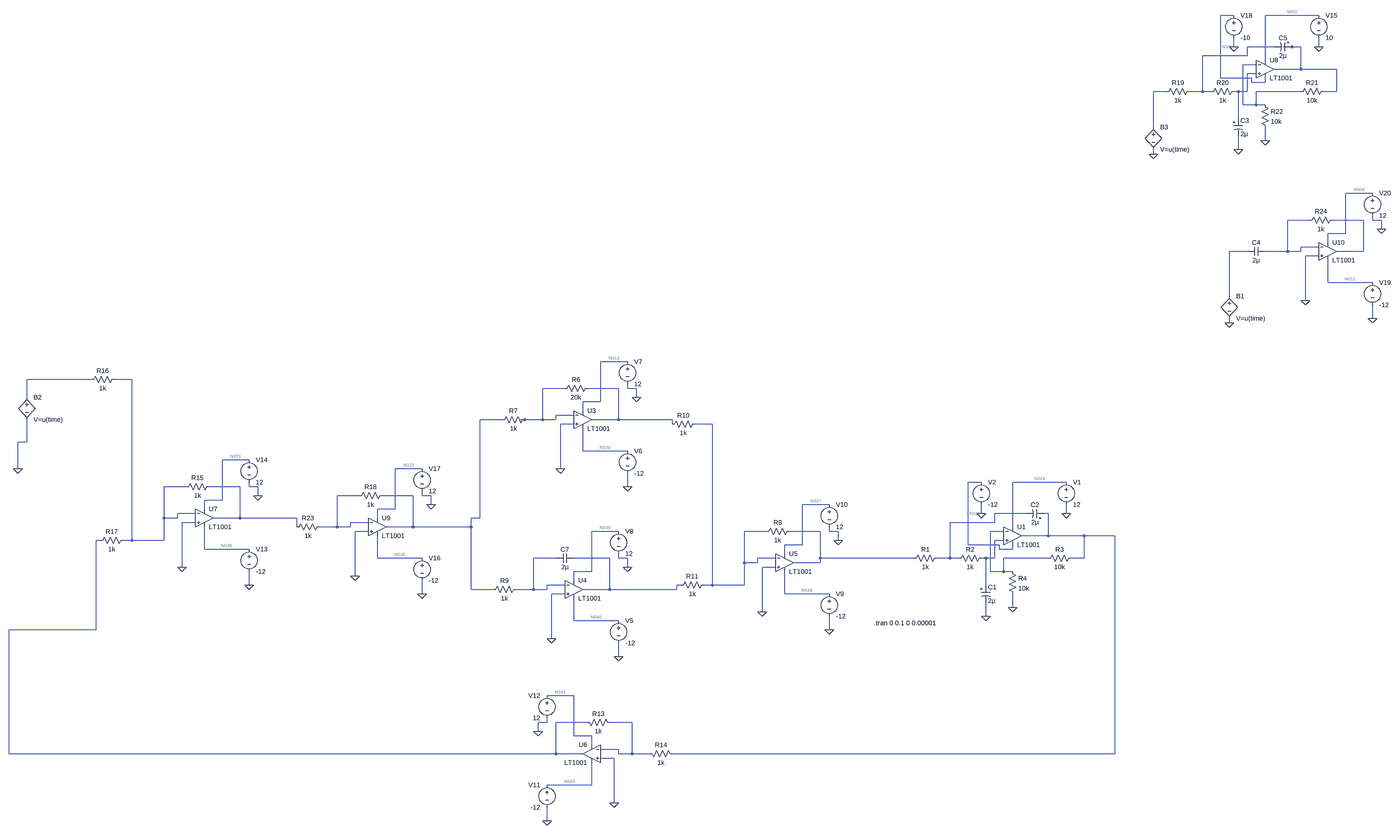
[diagram p0: schematic PI_Controller.asc, whole sheet]
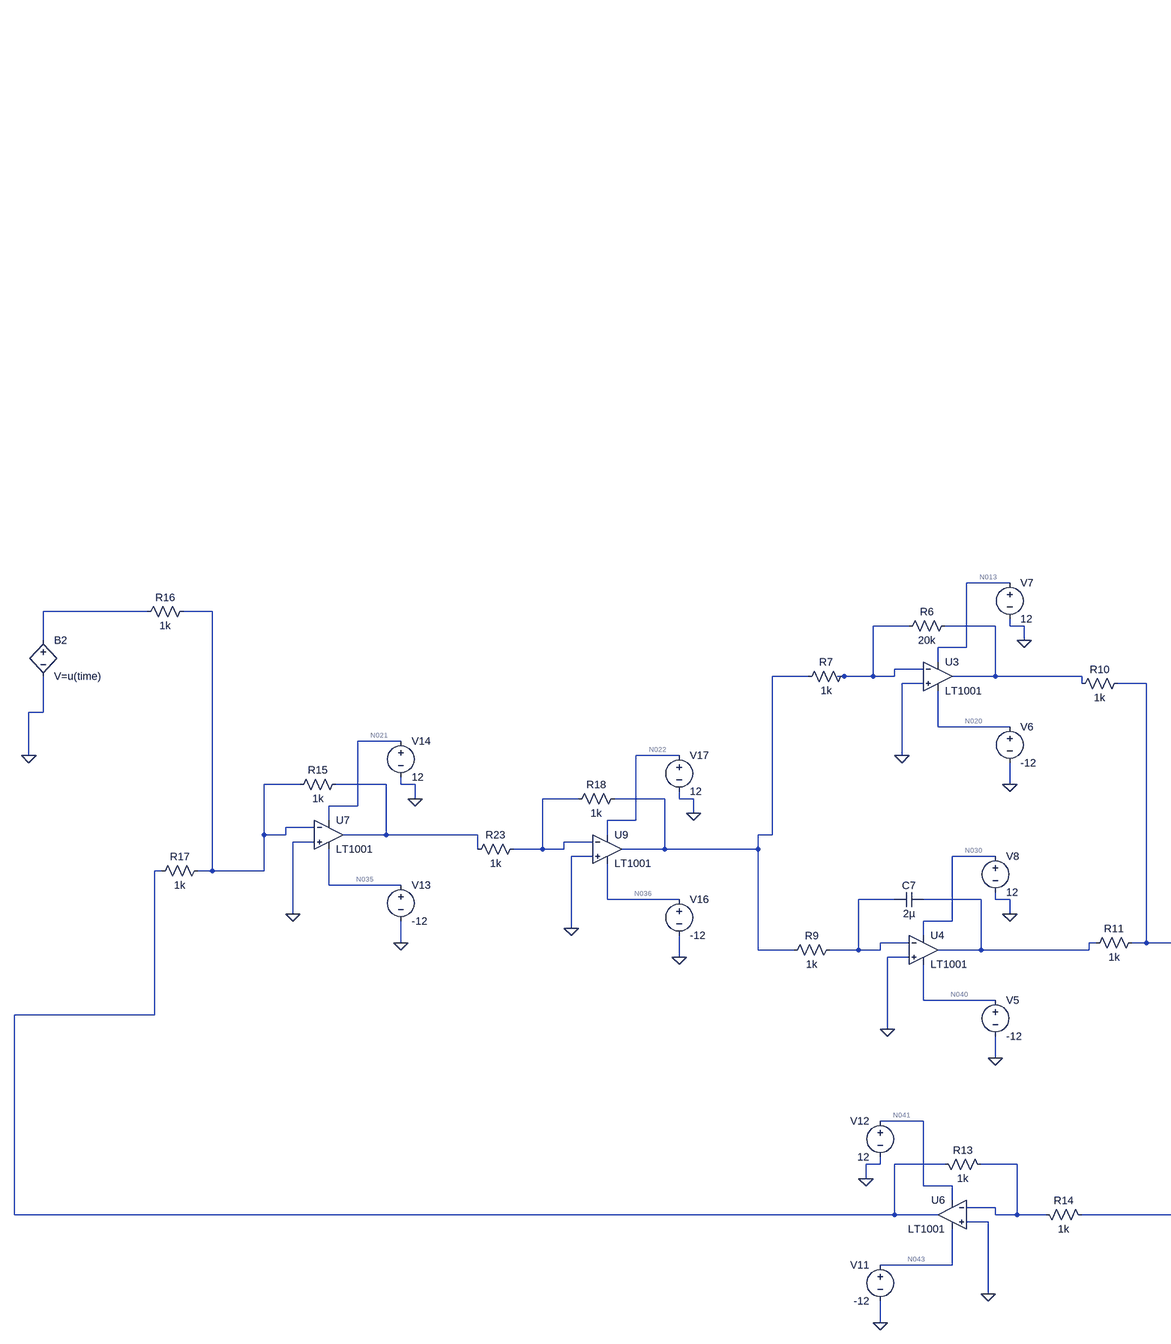
[diagram p1: schematic PI_Controller.asc, part, row 1 of 1, column 1 of 2]
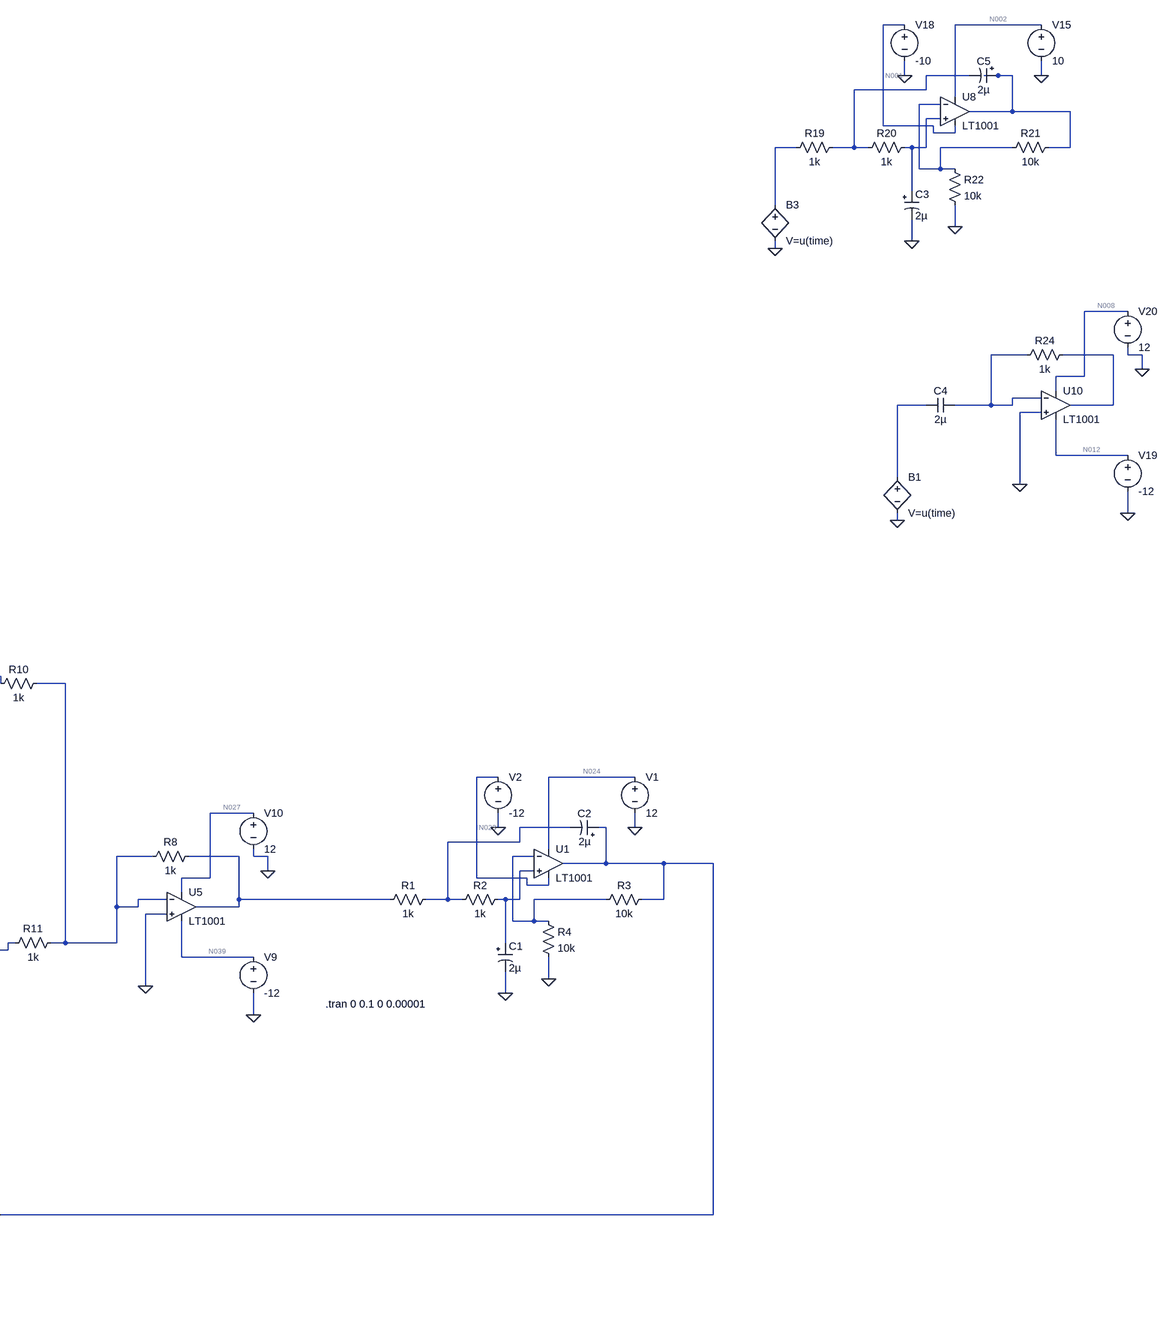
[diagram p2: schematic PI_Controller.asc, part, row 1 of 1, column 2 of 2]
PI_Controller.asc, the LTspice schematic file:
Version 4
SHEET 1 4088 1172
WIRE 3520 -2896 3472 -2896
WIRE 3824 -2896 3632 -2896
WIRE 3520 -2784 3520 -2816
WIRE 3664 -2784 3568 -2784
WIRE 3728 -2784 3696 -2784
WIRE 3760 -2784 3728 -2784
WIRE 3824 -2784 3824 -2816
WIRE 3568 -2752 3568 -2784
WIRE 3568 -2752 3408 -2752
WIRE 3632 -2736 3632 -2896
WIRE 3600 -2720 3552 -2720
WIRE 3760 -2704 3760 -2784
WIRE 3760 -2704 3664 -2704
WIRE 3888 -2704 3760 -2704
WIRE 3600 -2688 3568 -2688
WIRE 3472 -2672 3472 -2896
WIRE 3584 -2672 3472 -2672
WIRE 3584 -2656 3584 -2672
WIRE 3632 -2656 3632 -2672
WIRE 3632 -2656 3584 -2656
WIRE 3280 -2624 3232 -2624
WIRE 3408 -2624 3408 -2752
WIRE 3408 -2624 3360 -2624
WIRE 3440 -2624 3408 -2624
WIRE 3536 -2624 3520 -2624
WIRE 3568 -2624 3568 -2688
WIRE 3568 -2624 3536 -2624
WIRE 3760 -2624 3600 -2624
WIRE 3888 -2624 3888 -2704
WIRE 3888 -2624 3840 -2624
WIRE 3552 -2576 3552 -2720
WIRE 3600 -2576 3600 -2624
WIRE 3600 -2576 3552 -2576
WIRE 3632 -2576 3600 -2576
WIRE 3536 -2528 3536 -2624
WIRE 3232 -2496 3232 -2624
WIRE 3632 -2448 3632 -2496
WIRE 3536 -2416 3536 -2464
WIRE 3232 -2400 3232 -2416
WIRE 4016 -2256 3920 -2256
WIRE 3792 -2160 3712 -2160
WIRE 3984 -2160 3872 -2160
WIRE 4016 -2160 4016 -2176
WIRE 4048 -2160 4016 -2160
WIRE 4048 -2128 4048 -2160
WIRE 3920 -2112 3920 -2256
WIRE 3920 -2112 3856 -2112
WIRE 3856 -2080 3856 -2112
WIRE 3824 -2064 3760 -2064
WIRE 3568 -2048 3504 -2048
WIRE 3712 -2048 3712 -2160
WIRE 3712 -2048 3632 -2048
WIRE 3760 -2048 3760 -2064
WIRE 3760 -2048 3712 -2048
WIRE 3984 -2048 3984 -2160
WIRE 3984 -2048 3888 -2048
WIRE 3824 -2032 3776 -2032
WIRE 3856 -1936 3856 -2016
WIRE 4016 -1936 3856 -1936
WIRE 3504 -1888 3504 -2048
WIRE 3776 -1872 3776 -2032
WIRE 4016 -1808 4016 -1856
WIRE 3504 -1792 3504 -1808
WIRE -544 -1360 -640 -1360
WIRE -3408 -1296 -3648 -1296
WIRE -3264 -1296 -3328 -1296
WIRE -768 -1264 -848 -1264
WIRE -576 -1264 -688 -1264
WIRE -544 -1264 -544 -1280
WIRE -512 -1264 -544 -1264
WIRE -3648 -1232 -3648 -1296
WIRE -512 -1232 -512 -1264
WIRE -640 -1216 -640 -1360
WIRE -640 -1216 -704 -1216
WIRE -704 -1184 -704 -1216
WIRE -736 -1168 -800 -1168
WIRE -992 -1152 -1072 -1152
WIRE -912 -1152 -928 -1152
WIRE -848 -1152 -848 -1264
WIRE -848 -1152 -912 -1152
WIRE -800 -1152 -800 -1168
WIRE -800 -1152 -848 -1152
WIRE -576 -1152 -576 -1264
WIRE -576 -1152 -672 -1152
WIRE -384 -1152 -576 -1152
WIRE -736 -1136 -784 -1136
WIRE -384 -1136 -384 -1152
WIRE -240 -1136 -304 -1136
WIRE -3648 -1072 -3648 -1152
WIRE -3648 -1072 -3680 -1072
WIRE -704 -1040 -704 -1120
WIRE -544 -1040 -704 -1040
WIRE -2768 -1008 -2864 -1008
WIRE -3680 -976 -3680 -1072
WIRE -1824 -976 -1920 -976
WIRE -784 -976 -784 -1136
WIRE 800 -928 752 -928
WIRE 1104 -928 912 -928
WIRE -2992 -912 -3072 -912
WIRE -2800 -912 -2912 -912
WIRE -2768 -912 -2768 -928
WIRE -2736 -912 -2768 -912
WIRE -544 -912 -544 -960
WIRE -2736 -880 -2736 -912
WIRE -2048 -880 -2128 -880
WIRE -1856 -880 -1968 -880
WIRE -1824 -880 -1824 -896
WIRE -1792 -880 -1824 -880
WIRE -2864 -864 -2864 -1008
WIRE -2864 -864 -2928 -864
WIRE -1792 -848 -1792 -880
WIRE 256 -848 160 -848
WIRE -2928 -832 -2928 -864
WIRE -1920 -832 -1920 -976
WIRE -1920 -832 -1984 -832
WIRE -2960 -816 -3024 -816
WIRE 800 -816 800 -848
WIRE 960 -816 848 -816
WIRE 1040 -816 1024 -816
WIRE 1104 -816 1104 -848
WIRE -3072 -800 -3072 -912
WIRE -3024 -800 -3024 -816
WIRE -3024 -800 -3072 -800
WIRE -2800 -800 -2800 -912
WIRE -2800 -800 -2896 -800
WIRE -2272 -800 -2800 -800
WIRE -1984 -800 -1984 -832
WIRE -1072 -800 -1072 -1152
WIRE -1072 -800 -1104 -800
WIRE -2960 -784 -3008 -784
WIRE -2016 -784 -2080 -784
WIRE 848 -784 848 -816
WIRE 848 -784 688 -784
WIRE -2272 -768 -2272 -800
WIRE -2128 -768 -2128 -880
WIRE -2128 -768 -2192 -768
WIRE -2080 -768 -2080 -784
WIRE -2080 -768 -2128 -768
WIRE -1856 -768 -1856 -880
WIRE -1856 -768 -1952 -768
WIRE -1104 -768 -1104 -800
WIRE -1104 -768 -1856 -768
WIRE 912 -768 912 -928
WIRE -2016 -752 -2064 -752
WIRE -576 -752 -672 -752
WIRE 32 -752 -48 -752
WIRE 224 -752 112 -752
WIRE 256 -752 256 -768
WIRE 288 -752 256 -752
WIRE 880 -752 832 -752
WIRE 1040 -736 1040 -816
WIRE 1040 -736 944 -736
WIRE 1168 -736 1040 -736
WIRE 1408 -736 1168 -736
WIRE -3376 -720 -3392 -720
WIRE -3264 -720 -3264 -1296
WIRE -3264 -720 -3296 -720
WIRE -3072 -720 -3072 -800
WIRE -3072 -720 -3264 -720
WIRE 288 -720 288 -752
WIRE 880 -720 848 -720
WIRE 160 -704 160 -848
WIRE 160 -704 96 -704
WIRE 752 -704 752 -928
WIRE 864 -704 752 -704
WIRE -2928 -688 -2928 -768
WIRE -2768 -688 -2928 -688
WIRE 864 -688 864 -704
WIRE 912 -688 912 -704
WIRE 912 -688 864 -688
WIRE 96 -672 96 -704
WIRE -1984 -656 -1984 -736
WIRE -1824 -656 -1984 -656
WIRE -800 -656 -880 -656
WIRE -608 -656 -736 -656
WIRE -576 -656 -576 -672
WIRE -544 -656 -576 -656
WIRE 64 -656 0 -656
WIRE 224 -656 224 -752
WIRE 560 -656 224 -656
WIRE 688 -656 688 -784
WIRE 688 -656 640 -656
WIRE 720 -656 688 -656
WIRE 816 -656 800 -656
WIRE 848 -656 848 -720
WIRE 848 -656 816 -656
WIRE 1040 -656 880 -656
WIRE 1168 -656 1168 -736
WIRE 1168 -656 1120 -656
WIRE -48 -640 -48 -752
WIRE 0 -640 0 -656
WIRE 0 -640 -48 -640
WIRE 224 -640 224 -656
WIRE 224 -640 128 -640
WIRE -3008 -624 -3008 -784
WIRE -544 -624 -544 -656
WIRE 64 -624 16 -624
WIRE -672 -608 -672 -752
WIRE -672 -608 -736 -608
WIRE 832 -608 832 -752
WIRE 880 -608 880 -656
WIRE 880 -608 832 -608
WIRE 912 -608 880 -608
WIRE -2064 -592 -2064 -752
WIRE -736 -576 -736 -608
WIRE -2768 -560 -2768 -608
WIRE -768 -560 -832 -560
WIRE -352 -560 -368 -560
WIRE -240 -560 -240 -1136
WIRE -240 -560 -272 -560
WIRE -48 -560 -48 -640
WIRE -48 -560 -240 -560
WIRE 816 -560 816 -656
WIRE -1104 -544 -1104 -768
WIRE -1024 -544 -1104 -544
WIRE -880 -544 -880 -656
WIRE -880 -544 -944 -544
WIRE -832 -544 -832 -560
WIRE -832 -544 -880 -544
WIRE -608 -544 -608 -656
WIRE -608 -544 -704 -544
WIRE -368 -544 -368 -560
WIRE -368 -544 -608 -544
WIRE -1824 -528 -1824 -576
WIRE -768 -528 -816 -528
WIRE 96 -528 96 -608
WIRE 256 -528 96 -528
WIRE 912 -480 912 -528
WIRE 16 -464 16 -624
WIRE 816 -448 816 -496
WIRE -736 -432 -736 -512
WIRE -576 -432 -736 -432
WIRE -3392 -400 -3392 -720
WIRE -3392 -400 -3712 -400
WIRE 256 -400 256 -448
WIRE -816 -368 -816 -528
WIRE -576 -304 -576 -352
WIRE -736 688 -832 688
WIRE -832 784 -832 768
WIRE -832 784 -864 784
WIRE -688 784 -800 784
WIRE -528 784 -608 784
WIRE -864 816 -864 784
WIRE -736 832 -736 688
WIRE -672 832 -736 832
WIRE -672 864 -672 832
WIRE -576 880 -640 880
WIRE -3712 896 -3712 -400
WIRE -800 896 -800 784
WIRE -800 896 -3712 896
WIRE -704 896 -800 896
WIRE -576 896 -576 880
WIRE -528 896 -528 784
WIRE -528 896 -576 896
WIRE -464 896 -528 896
WIRE 1408 896 1408 -736
WIRE 1408 896 -384 896
WIRE -592 912 -640 912
WIRE -672 1008 -672 928
WIRE -672 1008 -832 1008
WIRE -592 1072 -592 912
WIRE -832 1136 -832 1088
FLAG 800 -816 0
FLAG 1104 -816 0
FLAG 816 -448 0
FLAG 912 -480 0
FLAG -784 -976 0
FLAG -512 -1232 0
FLAG -544 -912 0
FLAG -816 -368 0
FLAG -544 -624 0
FLAG -576 -304 0
FLAG 16 -464 0
FLAG 288 -720 0
FLAG 256 -400 0
FLAG -592 1072 0
FLAG -864 816 0
FLAG -832 1136 0
FLAG -3008 -624 0
FLAG -2736 -880 0
FLAG -2768 -560 0
FLAG -3680 -976 0
FLAG 3520 -2784 0
FLAG 3824 -2784 0
FLAG 3536 -2416 0
FLAG 3632 -2448 0
FLAG 3232 -2400 0
FLAG -2064 -592 0
FLAG -1792 -848 0
FLAG -1824 -528 0
FLAG 3776 -1872 0
FLAG 4048 -2128 0
FLAG 4016 -1808 0
FLAG 3504 -1792 0
SYMBOL res 656 -672 R90
WINDOW 0 0 56 VBottom 2
WINDOW 3 32 56 VTop 2
SYMATTR InstName R1
SYMATTR Value 1k
SYMBOL res 816 -672 R90
WINDOW 0 0 56 VBottom 2
WINDOW 3 32 56 VTop 2
SYMATTR InstName R2
SYMATTR Value 1k
SYMBOL res 1136 -672 R90
WINDOW 0 0 56 VBottom 2
WINDOW 3 32 56 VTop 2
SYMATTR InstName R3
SYMATTR Value 10k
SYMBOL res 896 -624 R0
SYMATTR InstName R4
SYMATTR Value 10k
SYMBOL OpAmps\\LT1001 912 -800 R0
SYMATTR InstName U1
SYMBOL voltage 1104 -944 R0
WINDOW 123 0 0 Left 0
WINDOW 39 0 0 Left 0
SYMATTR InstName V1
SYMATTR Value 12
SYMBOL voltage 800 -944 R0
WINDOW 123 0 0 Left 0
WINDOW 39 0 0 Left 0
SYMATTR InstName V2
SYMATTR Value -12
SYMBOL polcap 800 -560 R0
SYMATTR InstName C1
SYMATTR Value 2µ
SYMBOL polcap 1024 -800 M270
WINDOW 0 32 32 VTop 2
WINDOW 3 0 32 VBottom 2
SYMATTR InstName C2
SYMATTR Value 2µ
SYMBOL voltage -544 -1056 R0
WINDOW 123 0 0 Left 0
WINDOW 39 0 0 Left 0
SYMATTR InstName V6
SYMATTR Value -12
SYMBOL voltage -544 -1376 R0
WINDOW 123 0 0 Left 0
WINDOW 39 0 0 Left 0
SYMATTR InstName V7
SYMATTR Value 12
SYMBOL OpAmps\\LT1001 -704 -1216 R0
SYMATTR InstName U3
SYMBOL res -672 -1280 R90
WINDOW 0 0 56 VBottom 2
WINDOW 3 32 56 VTop 2
SYMATTR InstName R6
SYMATTR Value 20k
SYMBOL res -896 -1168 R90
WINDOW 0 0 56 VBottom 2
WINDOW 3 32 56 VTop 2
SYMATTR InstName R7
SYMATTR Value 1k
SYMBOL bv -3648 -1248 R0
SYMATTR InstName B2
SYMATTR Value V=u(time)
SYMBOL voltage -576 -448 R0
WINDOW 123 0 0 Left 0
WINDOW 39 0 0 Left 0
SYMATTR InstName V5
SYMATTR Value -12
SYMBOL voltage -576 -768 R0
WINDOW 123 0 0 Left 0
WINDOW 39 0 0 Left 0
SYMATTR InstName V8
SYMATTR Value 12
SYMBOL OpAmps\\LT1001 -736 -608 R0
SYMATTR InstName U4
SYMBOL res -928 -560 R90
WINDOW 0 0 56 VBottom 2
WINDOW 3 32 56 VTop 2
SYMATTR InstName R9
SYMATTR Value 1k
SYMBOL voltage 256 -544 R0
WINDOW 123 0 0 Left 0
WINDOW 39 0 0 Left 0
SYMATTR InstName V9
SYMATTR Value -12
SYMBOL voltage 256 -864 R0
WINDOW 123 0 0 Left 0
WINDOW 39 0 0 Left 0
SYMATTR InstName V10
SYMATTR Value 12
SYMBOL OpAmps\\LT1001 96 -704 R0
SYMATTR InstName U5
SYMBOL res 128 -768 R90
WINDOW 0 0 56 VBottom 2
WINDOW 3 32 56 VTop 2
SYMATTR InstName R8
SYMATTR Value 1k
SYMBOL res -288 -1152 R90
WINDOW 0 0 56 VBottom 2
WINDOW 3 32 56 VTop 2
SYMATTR InstName R10
SYMATTR Value 1k
SYMBOL res -256 -576 R90
WINDOW 0 0 56 VBottom 2
WINDOW 3 32 56 VTop 2
SYMATTR InstName R11
SYMATTR Value 1k
SYMBOL voltage -832 992 M0
WINDOW 123 0 0 Left 0
WINDOW 39 0 0 Left 0
SYMATTR InstName V11
SYMATTR Value -12
SYMBOL voltage -832 672 M0
WINDOW 123 0 0 Left 0
WINDOW 39 0 0 Left 0
SYMATTR InstName V12
SYMATTR Value 12
SYMBOL OpAmps\\LT1001 -672 832 M0
SYMATTR InstName U6
SYMBOL res -704 768 M90
WINDOW 0 0 56 VBottom 2
WINDOW 3 32 56 VTop 2
SYMATTR InstName R13
SYMATTR Value 1k
SYMBOL res -480 880 M90
WINDOW 0 0 56 VBottom 2
WINDOW 3 32 56 VTop 2
SYMATTR InstName R14
SYMATTR Value 1k
SYMBOL voltage -2768 -704 R0
WINDOW 123 0 0 Left 0
WINDOW 39 0 0 Left 0
SYMATTR InstName V13
SYMATTR Value -12
SYMBOL voltage -2768 -1024 R0
WINDOW 123 0 0 Left 0
WINDOW 39 0 0 Left 0
SYMATTR InstName V14
SYMATTR Value 12
SYMBOL OpAmps\\LT1001 -2928 -864 R0
SYMATTR InstName U7
SYMBOL res -2896 -928 R90
WINDOW 0 0 56 VBottom 2
WINDOW 3 32 56 VTop 2
SYMATTR InstName R15
SYMATTR Value 1k
SYMBOL res -3312 -1312 R90
WINDOW 0 0 56 VBottom 2
WINDOW 3 32 56 VTop 2
SYMATTR InstName R16
SYMATTR Value 1k
SYMBOL res -3280 -736 R90
WINDOW 0 0 56 VBottom 2
WINDOW 3 32 56 VTop 2
SYMATTR InstName R17
SYMATTR Value 1k
SYMBOL res 3376 -2640 R90
WINDOW 0 0 56 VBottom 2
WINDOW 3 32 56 VTop 2
SYMATTR InstName R19
SYMATTR Value 1k
SYMBOL res 3536 -2640 R90
WINDOW 0 0 56 VBottom 2
WINDOW 3 32 56 VTop 2
SYMATTR InstName R20
SYMATTR Value 1k
SYMBOL res 3856 -2640 R90
WINDOW 0 0 56 VBottom 2
WINDOW 3 32 56 VTop 2
SYMATTR InstName R21
SYMATTR Value 10k
SYMBOL res 3616 -2592 R0
SYMATTR InstName R22
SYMATTR Value 10k
SYMBOL OpAmps\\LT1001 3632 -2768 R0
SYMATTR InstName U8
SYMBOL voltage 3824 -2912 R0
WINDOW 123 0 0 Left 0
WINDOW 39 0 0 Left 0
SYMATTR InstName V15
SYMATTR Value 10
SYMBOL voltage 3520 -2912 R0
WINDOW 123 0 0 Left 0
WINDOW 39 0 0 Left 0
SYMATTR InstName V18
SYMATTR Value -10
SYMBOL polcap 3520 -2528 R0
SYMATTR InstName C3
SYMATTR Value 2µ
SYMBOL bv 3232 -2512 R0
SYMATTR InstName B3
SYMATTR Value V=u(time)
SYMBOL polcap 3728 -2800 R90
WINDOW 0 0 32 VBottom 2
WINDOW 3 32 32 VTop 2
SYMATTR InstName C5
SYMATTR Value 2µ
SYMBOL voltage -1824 -672 R0
WINDOW 123 0 0 Left 0
WINDOW 39 0 0 Left 0
SYMATTR InstName V16
SYMATTR Value -12
SYMBOL voltage -1824 -992 R0
WINDOW 123 0 0 Left 0
WINDOW 39 0 0 Left 0
SYMATTR InstName V17
SYMATTR Value 12
SYMBOL OpAmps\\LT1001 -1984 -832 R0
SYMATTR InstName U9
SYMBOL res -1952 -896 R90
WINDOW 0 0 56 VBottom 2
WINDOW 3 32 56 VTop 2
SYMATTR InstName R18
SYMATTR Value 1k
SYMBOL res -2176 -784 R90
WINDOW 0 0 56 VBottom 2
WINDOW 3 32 56 VTop 2
SYMATTR InstName R23
SYMATTR Value 1k
SYMBOL voltage 4016 -1952 R0
WINDOW 123 0 0 Left 0
WINDOW 39 0 0 Left 0
SYMATTR InstName V19
SYMATTR Value -12
SYMBOL voltage 4016 -2272 R0
WINDOW 123 0 0 Left 0
WINDOW 39 0 0 Left 0
SYMATTR InstName V20
SYMATTR Value 12
SYMBOL OpAmps\\LT1001 3856 -2112 R0
SYMATTR InstName U10
SYMBOL res 3888 -2176 R90
WINDOW 0 0 56 VBottom 2
WINDOW 3 32 56 VTop 2
SYMATTR InstName R24
SYMATTR Value 1k
SYMBOL bv 3504 -1904 R0
SYMATTR InstName B1
SYMATTR Value V=u(time)
SYMBOL cap 3568 -2064 M90
WINDOW 0 0 32 VBottom 2
WINDOW 3 32 32 VTop 2
SYMATTR InstName C4
SYMATTR Value 2µ
SYMBOL cap -736 -672 R90
WINDOW 0 0 32 VBottom 2
WINDOW 3 32 32 VTop 2
SYMATTR InstName C7
SYMATTR Value 2µ
TEXT 416 -424 Left 2 !.tran 0 0.1 0 0.00001

The netlist it stands for:
* PI_Controller.asc
R1 N028 N031 1k
R2 N034 N028 1k
R3 N029 N032 10k
R4 N032 0 10k
XU1 N034 N032 N024 N023 N029 LT1001  ; pins In+ In- V+ V- OUT
V1 N024 0 12
V2 N023 0 -12
C1 N034 0 2µ
C2 N029 N028 2µ
V6 N020 0 -12
V7 N013 0 12
XU3 0 N016 N013 N020 N017 LT1001  ; pins In+ In- V+ V- OUT
R6 N017 N016 20k
R7 N016 N018 1k
B2 N014 0 V=u(time)
V5 N040 0 -12
V8 N030 0 12
XU4 0 N037 N030 N040 N038 LT1001  ; pins In+ In- V+ V- OUT
R9 N037 N018 1k
V9 N039 0 -12
V10 N027 0 12
XU5 0 N019 N027 N039 N031 LT1001  ; pins In+ In- V+ V- OUT
R8 N031 N019 1k
R10 N019 N017 1k
R11 N019 N038 1k
V11 N043 0 -12
V12 N041 0 12
XU6 0 N042 N041 N043 N033 LT1001  ; pins In+ In- V+ V- OUT
R13 N033 N042 1k
R14 N042 N029 1k
V13 N035 0 -12
V14 N021 0 12
XU7 0 N015 N021 N035 N025 LT1001  ; pins In+ In- V+ V- OUT
R15 N025 N015 1k
R16 N015 N014 1k
R17 N015 N033 1k
R19 N003 N007 1k
R20 N006 N003 1k
R21 N004 N005 10k
R22 N005 0 10k
XU8 N006 N005 N002 N001 N004 LT1001  ; pins In+ In- V+ V- OUT
V15 N002 0 10
V18 N001 0 -10
C3 N006 0 2µ
B3 N007 0 V=u(time)
C5 N004 N003 2µ
V16 N036 0 -12
V17 N022 0 12
XU9 0 N026 N022 N036 N018 LT1001  ; pins In+ In- V+ V- OUT
R18 N018 N026 1k
R23 N026 N025 1k
V19 N012 0 -12
V20 N008 0 12
XU10 0 N009 N008 N012 N010 LT1001  ; pins In+ In- V+ V- OUT
R24 N010 N009 1k
B1 N011 0 V=u(time)
C4 N011 N009 2µ
C7 N038 N037 2µ
.tran 0 0.1 0 0.00001
.lib LTC.lib
.backanno
.end

* Results of the author's LTspice run, read from the files saved beside the schematic
* Operating Point, zero values left out:
*   V(n024) = 12 V
*   V(n023) = -12 V
*   V(n020) = -12 V
*   V(n013) = 12 V
*   V(n040) = -12 V
*   V(n030) = 12 V
*   V(n039) = -12 V
*   V(n027) = 12 V
*   V(n043) = -12 V
*   V(n041) = 12 V
*   V(n035) = -12 V
*   V(n021) = 12 V
*   V(n002) = 10 V
*   V(n001) = -10 V
*   V(n036) = -12 V
*   V(n022) = 12 V
*   V(n012) = -12 V
*   V(n008) = 12 V
*   I(V20) = -2.25 mA
*   I(V19) = 2.25 mA
*   I(V17) = -2.25 mA
*   I(V16) = 2.25 mA
*   I(V18) = 2.25 mA
*   I(V15) = -2.25 mA
*   I(V14) = -2.25 mA
*   I(V13) = 2.25 mA
*   I(V12) = -2.25 mA
*   I(V11) = 2.25 mA
*   I(V10) = -2.25 mA
*   I(V9) = 2.25 mA
*   I(V8) = -2.25 mA
*   I(V5) = 2.25 mA
*   I(V7) = -2.25 mA
*   I(V6) = 2.25 mA
*   I(V2) = 2.25 mA
*   I(V1) = -2.25 mA